# Altium project Proje01.PrjPcb
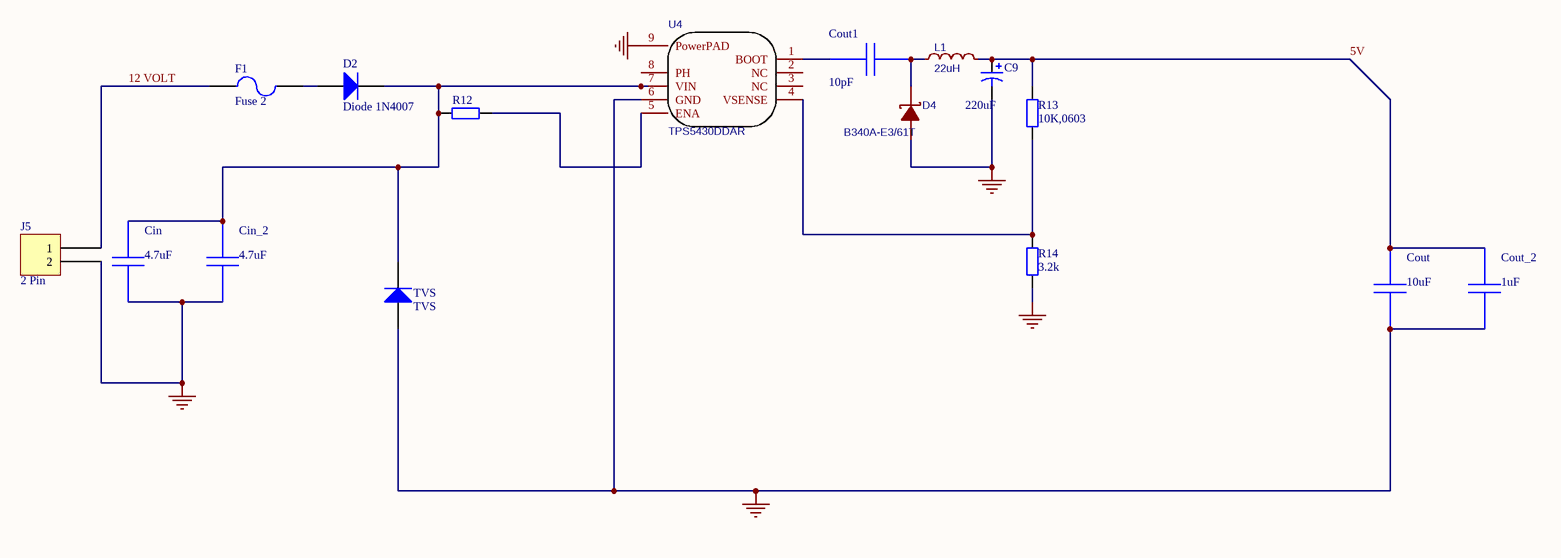
[diagram p0: POWER.schdoc]
2 sheets, 57 parts. Net scope: global (net labels, ports and power ports of the same name join across sheets).
Board file: STM32.PcbDoc
Sheets:
  POWER.schdoc
  STM32.SchDoc

## Sheet POWER.schdoc
size 508 x 254 mm; SheetNumber: 1; SheetTotal: 1

### Parts
C9  value 220uF  [1206]  (hidden comment: Cap Pol3)
Cin  value 4.7uF  [1206]  (hidden comment: GRM32ER71J106KA12L)
Cin_2  value 4.7uF  [1206]  (hidden comment: GRM32ER71J106KA12L)
Cout  value 10uF  [1206]  (hidden comment: C1608X5R1A226M080AC)
Cout1  value 10pF  [1206]  (hidden comment: C1608X5R1A226M080AC)
Cout_2  value 1uF  [1206]  (hidden comment: C1608X5R1A226M080AC)
D2  Diode 1N4007  [SMA(DO-214AC)]
D4  B340A-E3/61T  [SMA(DO-214AC)]
F1  Fuse 2  [1206]
J5  2 Pin  [HDR1X2]
L1  22uH  [l7070]
R12  (no value)  [0805]
R13  10K,0603  [0805]
R14  3.2k  [0805]
TVS  TVS  [SMA(DO-214AC)]
U4  TPS5430DDAR  [SOP-8_EP_150MIL]

### Nets
0: C9.2 Cin.2 Cin_2.2 Cout.2 Cout_2.2 D4.1(A) J5.2 R14.1 TVS.1(A) U4.6(GND) U4.9(PowerPAD)
5V: C9.1 Cout.1 Cout_2.1 L1.2 R13.2
12 VOLT: F1.1 J5.1
NetCin_1: Cin.1 Cin_2.1 D2.2(K) R12.2 TVS.2(K) U4.7(VIN)
NetCout1_1: Cout1.1 U4.1(BOOT)
NetCout1_2: Cout1.2 D4.2(K) L1.1
NetD2_1: D2.1(A) F1.2
NetR12_1: R12.1 U4.5(ENA)
NetR13_1: R13.1 R14.2 U4.4(VSENSE)

Not connected (* = marked no-connect by the designer): U4 2(NC) 3(NC) 8(PH)

### Library data of the parts
C9 = Cap Pol3: Polarized Capacitor (Surface Mount); Published: 8-Jun-2000; LatestRevisionDate: 29-May-2009; LatestRevisionNote: IPC-7351 Footprint Added.; PackageReference: C0805; Publisher: Altium Limited; PackageDescription: Chip Capacitor
Cin Cin_2 = GRM32ER71J106KA12L: GRM32ER71J106KA1; Manufacturer Name: MuRata; PackageReference: GRM32ER71J106KA12L; Manufacturer Part Number: GRM32ER71J106KA12L
Cout Cout1 Cout_2 = C1608X5R1A226M080AC: C1608X5R1A226M08; Manufacturer Name: TDK; PackageReference: C1608X5R1A226M080AC; Manufacturer Part Number: C1608X5R1A226M080AC
D2 TVS = Diode 1N4007: 1 Amp General Purpose Rectifier; Published: 8-Jun-2000; LatestRevisionDate: 17-Jul-2002; LatestRevisionNote: Re-released for DXP Platform.; DatasheetVersion: 1998; PackageVersion: Aug-1999; PackageReference: DO-41; Publisher: Altium Limited; PackageDescription: Diode, Axial; Body 5.2 x 2.7 mm (LxDia. max), Lead Dia. 0.86 mm (max); Code_JEDEC: DO-204-AL; ComponentLink1Description: Manufacturer Link; ComponentLink1URL: http://www.fairchildsemi.com/; ComponentLink2Description: Datasheet; ComponentLink2URL: http://www.fairchildsemi.com/ds/1N%2F1N4001.pdf
D4 = B340A-E3/61T: BOM_Manufacturer: VISHAY; BOM_Supplier: LCSC; BOM_Manufacturer Part: B340A-E3/61T; image: //image.lceda.cn/szlcsc/C15570.jpg; BOM_Supplier Part: C15570; spicePre: D
F1 = Fuse 2: Fuse; Published: 8-Jun-2000; LatestRevisionDate: 17-Jul-2002; LatestRevisionNote: Re-released for DXP Platform.; PackageReference: PIN-W2/E2.8; Publisher: Altium Limited; PackageDescription: Thru-Hole; 2 Leads
L1 = 100uH: BOM_Manufacturer: TAITEC; BOM_Manufacturer Part: NLV32T-150J-PF; nameAlias: Inductance; Contributor: LCSC; BOM_Supplier: LCSC; BOM_Supplier Part: C304294; spicePre: L; spiceSymbolName: FPI0705F-101M
R12-R14 = Res2: Resistor; Published: 8-Jun-2000; LatestRevisionDate: 17-Jul-2002; LatestRevisionNote: Re-released for DXP Platform.; Publisher: Altium Limited
U4 = TPS5430DDAR: BOM_Manufacturer: TI; BOM_Supplier: LCSC; BOM_Manufacturer Part: TPS5430DDAR; BOM_LCSC Assembly: Yes; image: //image.lceda.cn/szlcsc/C9864.jpg; BOM_Supplier Part: C9864; spicePre: U

## Sheet STM32.SchDoc
size A4
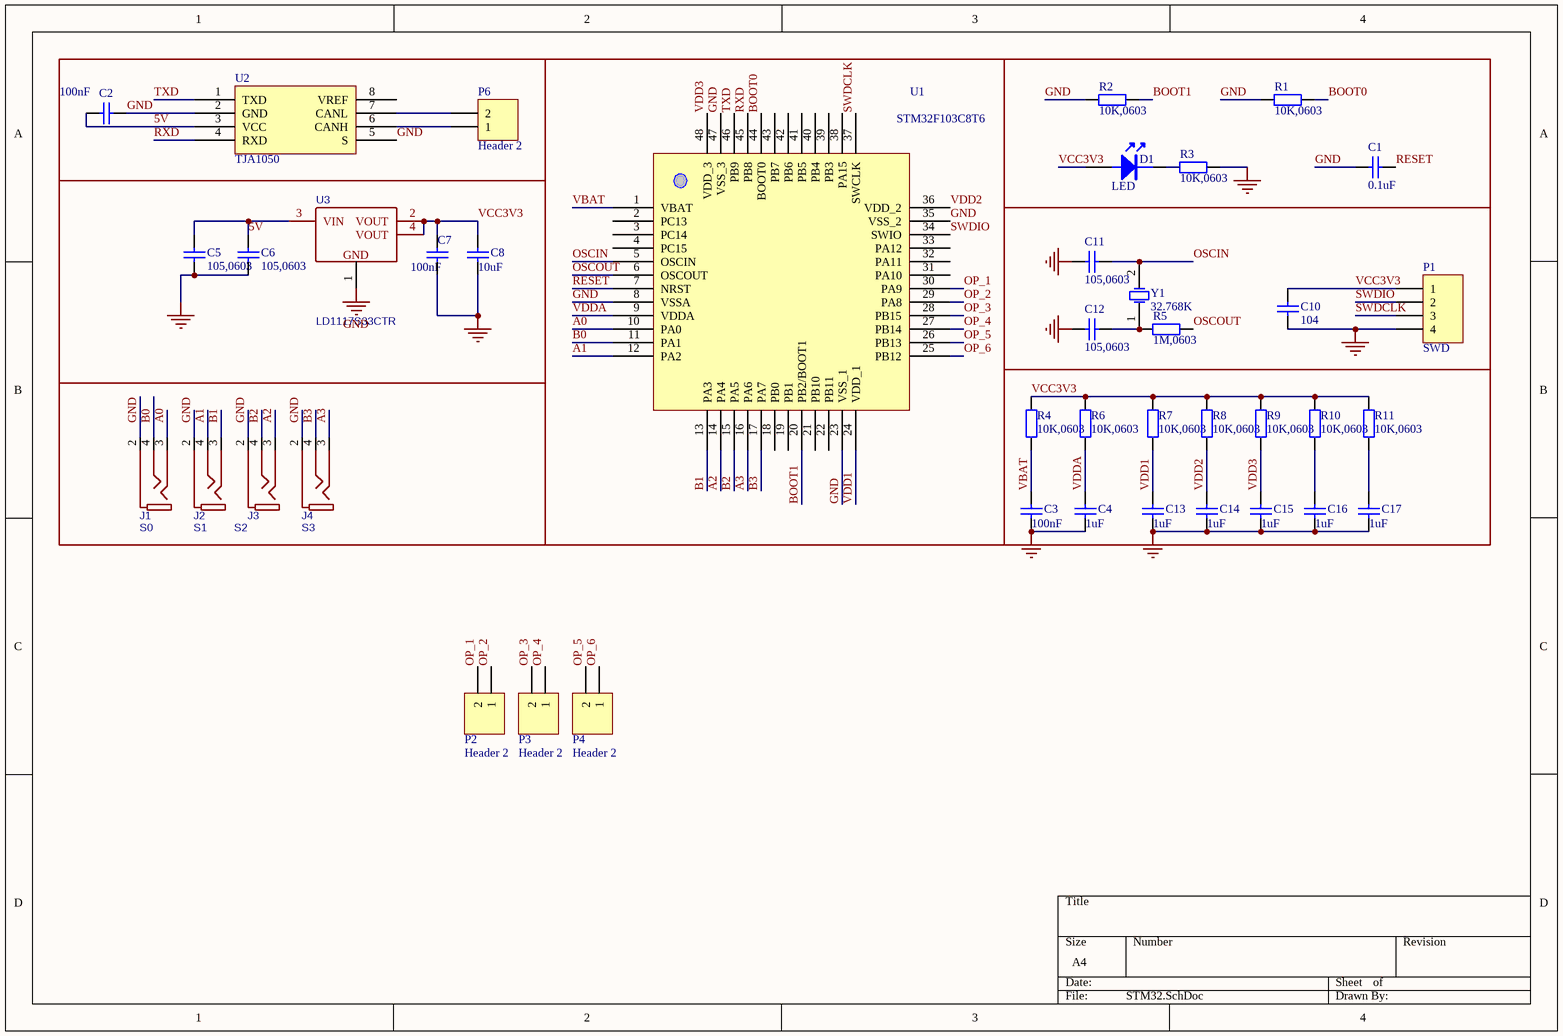
[diagram p1: STM32.SchDoc]

### Parts
C1  0.1uF  [0805]
C2  100nF  [0805]
C3  100nF  [0805]
C4  1uF  [0805]
C5  105,0603  [0805]
C6  105,0603  [0805]
C7  value 100nF  [0805]
C8  value 10uF  [0805]  (hidden comment: 105,0603)
C10  104  [0805]
C11  105,0603  [0805]
C12  105,0603  [0805]
C13  1uF  [0805]
C14  1uF  [0805]
C15  1uF  [0805]
C16  1uF  [0805]
C17  1uF  [0805]
D1  LED  [LED]
J1  S0  [AUDIO-PJ313D]
J2  S1  [AUDIO-PJ313D]
J3  S2  [AUDIO-PJ313D]
J4  S3  [AUDIO-PJ313D]
P1  SWD  [HDR1X4H]
P2  Header 2  [HDR1X2]
P3  Header 2  [HDR1X2]
P4  Header 2  [HDR1X2]
P6  Header 2  [HDR1X2]
R1  10K,0603  [0805]
R2  10K,0603  [0805]
R3  10K,0603  [0805]
R4  10K,0603  [0805]
R5  1M,0603  [0805]
R6  10K,0603  [0805]
R7  10K,0603  [0805]
R8  10K,0603  [0805]
R9  10K,0603  [0805]
R10  10K,0603  [0805]
R11  10K,0603  [0805]
U1  STM32F103C8T6  [48P]
U2  TJA1050  [SOIC-8_150MIL]
U3  LD1117S33CTR  [SOT-223]
Y1  32.768K  [XTAL1]

### Nets
GND: C1.1 C2.1 C3.1 C4.1 C5.1 C6.1 C7.1 C8.1 C10.1 C11.1 C12.1 C13.1 C14.1 C15.1 C16.1 C17.1 J1.2 J2.2 J3.2 J4.2 P1.4 R1.1 R2.1 R3.2 U1.8(VSSA) U1.23(VSS_1) U1.35(VSS_2) U1.47(VSS_3) U2.2(GND) U2.5(S) U3.1(GND)
5V: C2.2 C5.2 C6.2 U2.3(VCC) U3.3(VIN)
A0: J1.3 U1.10(PA0)
A1: J2.4 U1.12(PA2)
A2: J3.3 U1.14(PA4)
A3: J4.3 U1.16(PA6)
B0: J1.4 U1.11(PA1)
B1: J2.3 U1.13(PA3)
B2: J3.4 U1.15(PA5)
B3: J4.4 U1.17(PA7)
BOOT0: R1.2 U1.44(BOOT0)
BOOT1: R2.2 U1.20(PB2/BOOT1)
OP_1: P2.2 U1.30(PA9)
OP_2: P2.1 U1.29(PA8)
OP_3: P3.2 U1.28(PB15)
OP_4: P3.1 U1.27(PB14)
OP_5: P4.2 U1.26(PB13)
OP_6: P4.1 U1.25(PB12)
OSCIN: C11.2 U1.5(OSCIN) Y1.2(OSC2)
OSCOUT: R5.1 U1.6(OSCOUT)
RESET: C1.2 U1.7(NRST)
RXD: U1.45(PB8) U2.4(RXD)
SWDCLK: P1.3 U1.37(SWCLK)
SWDIO: P1.2 U1.34(SWIO)
TXD: U1.46(PB9) U2.1(TXD)
VBAT: C3.2 R4.1 U1.1(VBAT)
VCC3V3: C7.2 C8.2 C10.2 D1.A P1.1 R4.2 R6.2 R7.2 R8.2 R9.2 R10.2 R11.2 U3.2(VOUT) U3.4(VOUT)
VDD1: C13.2 R7.1 U1.24(VDD_1)
VDD2: C14.2 R8.1 U1.36(VDD_2)
VDD3: C15.2 R9.1 U1.48(VDD_3)
VDDA: C4.2 R6.1 U1.9(VDDA)
NetC12_2: C12.2 R5.2 Y1.1(OSC1)
NetC16_2: C16.2 R10.1
NetC17_2: C17.2 R11.1
NetD1_K: D1.K R3.1
NetP6_1: P6.1 U2.6(CANH)
NetP6_2: P6.2 U2.7(CANL)

Not connected (* = marked no-connect by the designer): U1 2(PC13) 3(PC14) 4(PC15) 18(PB0) 19(PB1) 21(PB10) 22(PB11) 31(PA10) 32(PA11) 33(PA12) 38(PA15) 39(PB3) 40(PB4) 41(PB5) 42(PB6) 43(PB7); U2 8(VREF)

### Library data of the parts
C1-C6 C11-C17 = Cap: Capacitor; Value: 104; Published: 8-Jun-2000; LatestRevisionDate: 17-Jul-2002; LatestRevisionNote: Re-released for DXP Platform.; Publisher: Altium Limited
C7 C8 C10 = Cap: Capacitor; Published: 8-Jun-2000; LatestRevisionDate: 17-Jul-2002; LatestRevisionNote: Re-released for DXP Platform.; Publisher: Altium Limited
  C10: Value: 104
D1 = LED: pin to pad: A>1 K>2
J1-J4 = Stereo-jack: BOM_Manufacturer: BOOMELE; BOM_Manufacturer Part: Straight headphone jack; BOM_Supplier: LCSC; BOM_Supplier Part: C18167; spicePre: J
P1 = Header 4: Header, 4-Pin; LatestRevisionDate: 17-Jul-2002; LatestRevisionNote: Re-released for DXP Platform.; Publisher: Altium Limited
P2-P4 P6 = Header 2: Header, 2-Pin; LatestRevisionDate: 17-Jul-2002; LatestRevisionNote: Re-released for DXP Platform.; Publisher: Altium Limited
R1-R11 = Res2: Resistor; Published: 8-Jun-2000; LatestRevisionDate: 17-Jul-2002; LatestRevisionNote: Re-released for DXP Platform.; Publisher: Altium Limited
U3 = LD1117S33CTR: BOM_Manufacturer: STMicroelectronics; BOM_Supplier: LCSC; BOM_Manufacturer Part: LD1117S33CTR; image: //image.lceda.cn/szlcsc/C35879.jpg; BOM_Supplier Part: C35879; spicePre: U
Y1 = XTAL: Crystal Oscillator; Published: 8-Jun-2000; LatestRevisionDate: 17-Jul-2002; LatestRevisionNote: Re-released for DXP Platform.; Publisher: Altium Limited

## Nets that join several sheets
5V: POWER (5 pins), STM32 (5 pins)